# EAGLE design ESP01 Breakout (EAGLE 6.5.0)
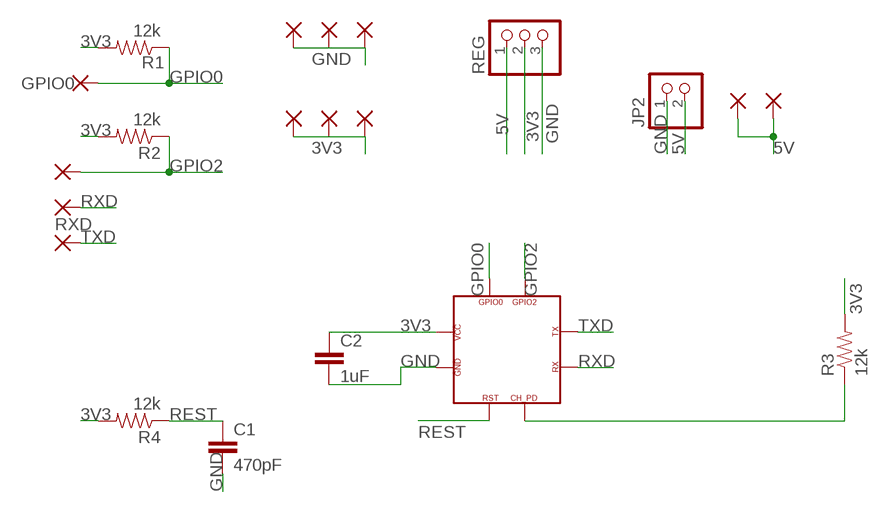
[diagram p0: schematic, sheet 1]

## Parts
C1  470pF  CAPEZ  [CAP-PTH-SMALLEZ]
C2  1uF  CAPEZ  [CAP-PTH-SMALLEZ]
GPIO0  1,6/0,9  [1,6/0,9]
GPIO1  1,6/0,9  [1,6/0,9]
GPIO2  1,6/0,9  [1,6/0,9]
GPIO3  1,6/0,9  [1,6/0,9]
GPIO4  1,6/0,9  [1,6/0,9]
GPIO5  1,6/0,9  [1,6/0,9]
GPIO6  1,6/0,9  [1,6/0,9]
GPIO7  1,6/0,9  [1,6/0,9]
GPIO8  1,6/0,9  [1,6/0,9]
GPIO9  1,6/0,9  [1,6/0,9]
GPIO10  1,6/0,9  [1,6/0,9]
JP2  PINHD-1X2/90  [1X02/90]
R1  12k  RESISTORPTH-1/4W  [AXIAL-0.4]
R2  12k  RESISTORPTH-1/4W  [AXIAL-0.4]
R3  12k  RESISTORPTH-1/4W  [AXIAL-0.4]
R4  12k  RESISTORPTH-1/4W  [AXIAL-0.4]
REG  PINHD-1X3  [1X03]
RXD  RXD  1,6/0,9  [1,6/0,9]
U$2  ESP-01  [ESP-01]

## Nets
3V3: C2.1 GPIO6.1(P) GPIO7.1(P) GPIO8.1(P) R1.P$2 R2.P$2 R3.P$2 R4.P$2 REG.2 U$2.VCC
5V: GPIO9.1(P) GPIO10.1(P) JP2.2 REG.1
GND: C1.2 C2.2 GPIO1.1(P) GPIO4.1(P) GPIO5.1(P) JP2.1 REG.3 U$2.GND
GPIO0: GPIO0.1(P) R1.P$1 U$2.GPIO0
GPIO2: GPIO2.1(P) R2.P$1 U$2.GPIO2
N$3: R3.P$1 U$2.CH_PD(CP_PD)
REST: C1.1 R4.P$1 U$2.RST
RXD: RXD.1(P) U$2.RXD(RX)
TXD: GPIO3.1(P) U$2.TXD(TX)

## Library data of the parts
C1 C2 = SparkFun-Capacitors:CAP: Capacitor Standard 0603 ceramic capacitor, and 0.1" leaded capacitor.
GPIO0 GPIO1-GPIO10 RXD = wirepad:1,6/0,9: THROUGH-HOLE PAD
JP2 = pinhead:PINHD-1X2: PIN HEADER
R1-R4 = SparkFun-Passives:RESISTOR: Resistor Basic schematic elements and footprints for 0603, 1206, and PTH resistors.
REG = pinhead:PINHD-1X3: PIN HEADER
U$2 = Franc:ESP-01

## Board
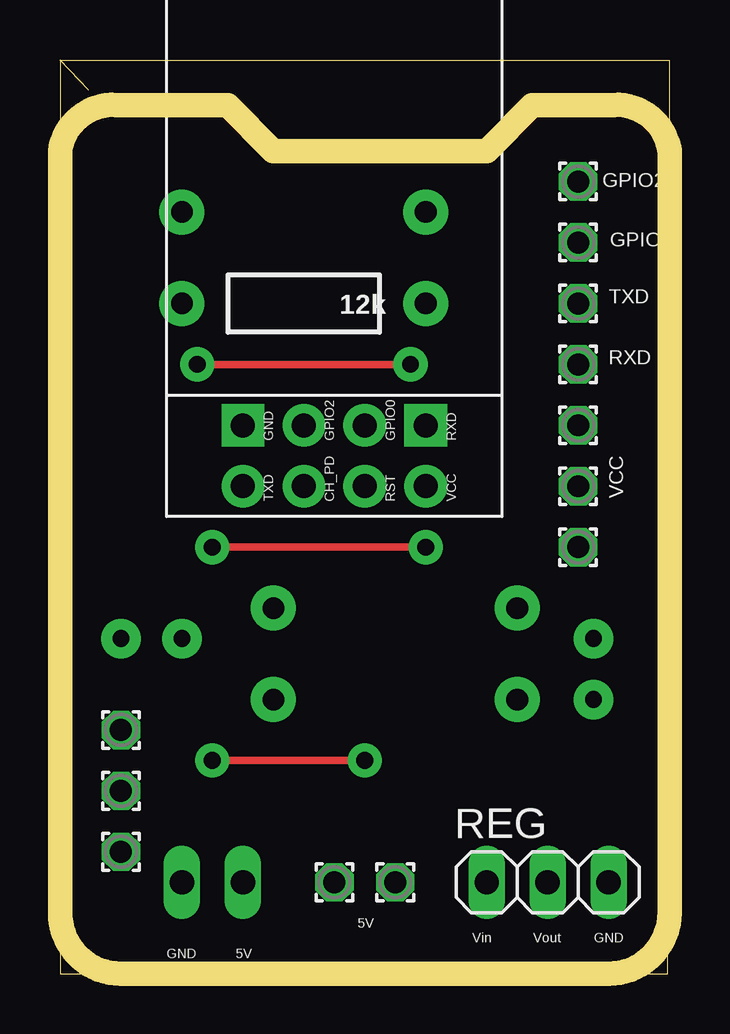
[diagram p1: board, top side]
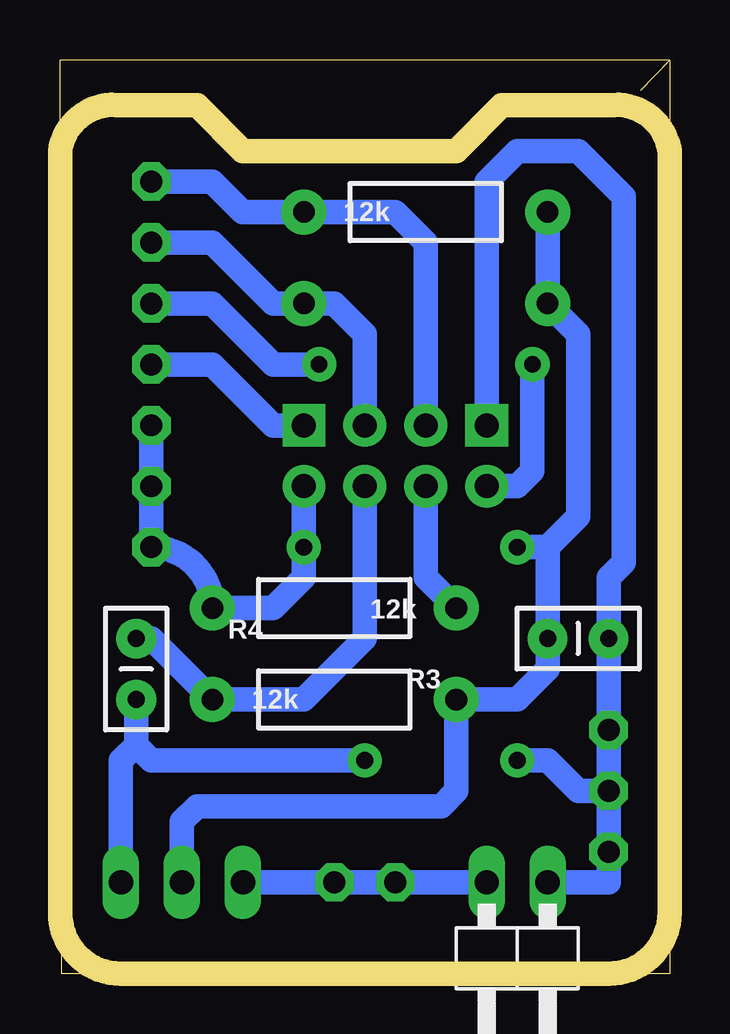
[diagram p2: board, bottom side, seen from below]

Size 25.4 x 38.1 mm. Coordinates in mm from the lower left corner, seen from the top.
Outline: 25.32,0.01 0,0.01 0,38.1
Outline: 1.19,36.83 0,38.1
Outline: 0,38.1 25.4,38.1 25.32,0
Copper layers (1*16): Top 0.035mm / dielectric 1.5mm / Bottom 0.035mm
Design rules "default": minimum track width 10mil, minimum drill 24mil, track to track 8mil, track to pad 8mil, pad to pad 8mil, via to via 8mil, smd to smd 8mil, copper to edge 40mil, drill to drill 8mil, minimum pad ring 10mil, minimum via ring 8mil, stop-mask expansion 4mil, vias tented up to drill 0mil, thermal gap 10mil
Milling: 12 lines

### Footprints (pad centres in the part's own frame; a part is rotated, then mirrored left to right if it is on the bottom)
CAP-PTH-SMALLEZ = drill 0.7 pad 1.651: 1 0,0; 2 2.54,0
1,6/0,9 = drill 0.914 pad 1.6 octagon: 1 0,0
1X02/90 = drill 1.016 long: 1 -1.27,-3.81; 2 1.27,-3.81
AXIAL-0.4 = drill 0.9 pad 1.88: P$1 -5.08,0; P$2 5.08,0
1X03 = drill 1.016 long: 1 -2.54,0; 2 0,0; 3 2.54,0
ESP-01 = drill 1 pad 1.778: CH_PD -1.27,1.27; GPIO0 1.27,-1.27; GPIO2 1.27,1.27; RST -1.27,-1.27; TXD -1.27,3.81; VCC -1.27,-3.81 | drill 1 pad 1.778 square: GND 1.27,3.81; RXD 1.27,-3.81

### Placement (x,y rotation side)
C1  22.23,13.98 270 bottom
C2  5.08,13.98 0 bottom
GPIO0  21.59,30.49 270 top
GPIO1  2.54,10.17 0 top
GPIO2  21.59,33.03 0 top
GPIO3  21.59,27.95 0 top
GPIO4  2.54,5.09 0 top
GPIO5  2.54,7.63 0 top
GPIO6  21.59,22.87 0 top
GPIO7  21.59,20.33 0 top
GPIO8  21.59,17.79 0 top
GPIO9  13.97,3.82 0 top
GPIO10  11.43,3.82 0 top
JP2  6.35,0.01 180 bottom
R1  10.16,27.95 180 top
R2  10.16,31.76 0 bottom
R3  13.97,15.25 180 bottom
R4  13.97,11.44 0 bottom
REG  20.32,3.82 0 top
RXD  21.59,25.41 0 top
U$2  11.43,21.6 90 top

### Tracks (layer width: path | path; a pad name or v marks a point on that pad's centre or on a via)
3V3  (via drill 0.7 pad 1.42)
  Top 0.305: v15.24,17.79 v6.35,17.79
  Bottom 1.016: R2.P$2 R1.P$2 3.81,26.68 3.81,19.06 5.08,17.79 | U$2.VCC v15.24,17.79 15.24,16.52 16.51,15.25 R3.P$2 arc-90 GPIO8.1 GPIO7.1 GPIO6.1 | REG.2 20.32,6.36 19.68,7 9.53,7 8.89,7.63 R4.P$2 6.35,11.44 5.08,12.71 C2.1 5.08,17.79 | v6.35,17.79 5.08,17.79
5V
  Bottom 1.016: JP2.2 GPIO10.1 GPIO9.1 REG.1
GND  (via drill 0.7 pad 0.81, 0.7 pad 1.02, 0.7 pad 1.42)
  Top 0.305: v12.7,8.9 v6.35,8.9
  Bottom 1.016: U$2.GND 7.62,33.03 6.35,34.3 3.81,34.3 1.91,32.39 1.91,17.16 2.54,16.52 C2.2 GPIO1.1 GPIO5.1 | JP2.1 2.54,3.82 GPIO4.1 GPIO5.1 | v6.35,8.9 5.08,8.9 3.81,7.63 GPIO5.1 | C1.2 22.23,9.54 | 22.23,9.54 22.86,8.9 REG.3 | v12.7,8.9 21.59,8.9 22.23,9.54
GPIO0
  Bottom 1.016: U$2.GPIO0 12.7,26.68 13.97,27.95 R1.P$1 16.51,27.95 19.05,30.49 GPIO0.1
GPIO2
  Bottom 1.016: U$2.GPIO2 10.16,30.49 11.43,31.76 R2.P$1 17.78,31.76 19.05,33.03 GPIO2.1
N$3
  Bottom 1.016: R3.P$1 10.16,16.52 U$2.CH_PD
REST
  Bottom 1.016: U$2.RST 12.7,13.98 15.24,11.44 R4.P$1 21.59,13.98 C1.1
RXD
  Bottom 1.016: RXD.1 19.05,25.41 16.51,22.87 U$2.RXD
TXD  (via drill 0.7 pad 1.42)
  Top 0.305: v5.71,25.41 v14.61,25.41
  Bottom 1.016: U$2.TXD 6.35,20.33 5.71,20.96 v5.71,25.41 | v14.61,25.41 16.51,25.41 19.05,27.95 GPIO3.1

### Text on the board
tNames: TXD | RXD | VCC | 5V | GND | 5V | Vin | Vout | GND